# EAGLE design Calibration (EAGLE 9.2.2)
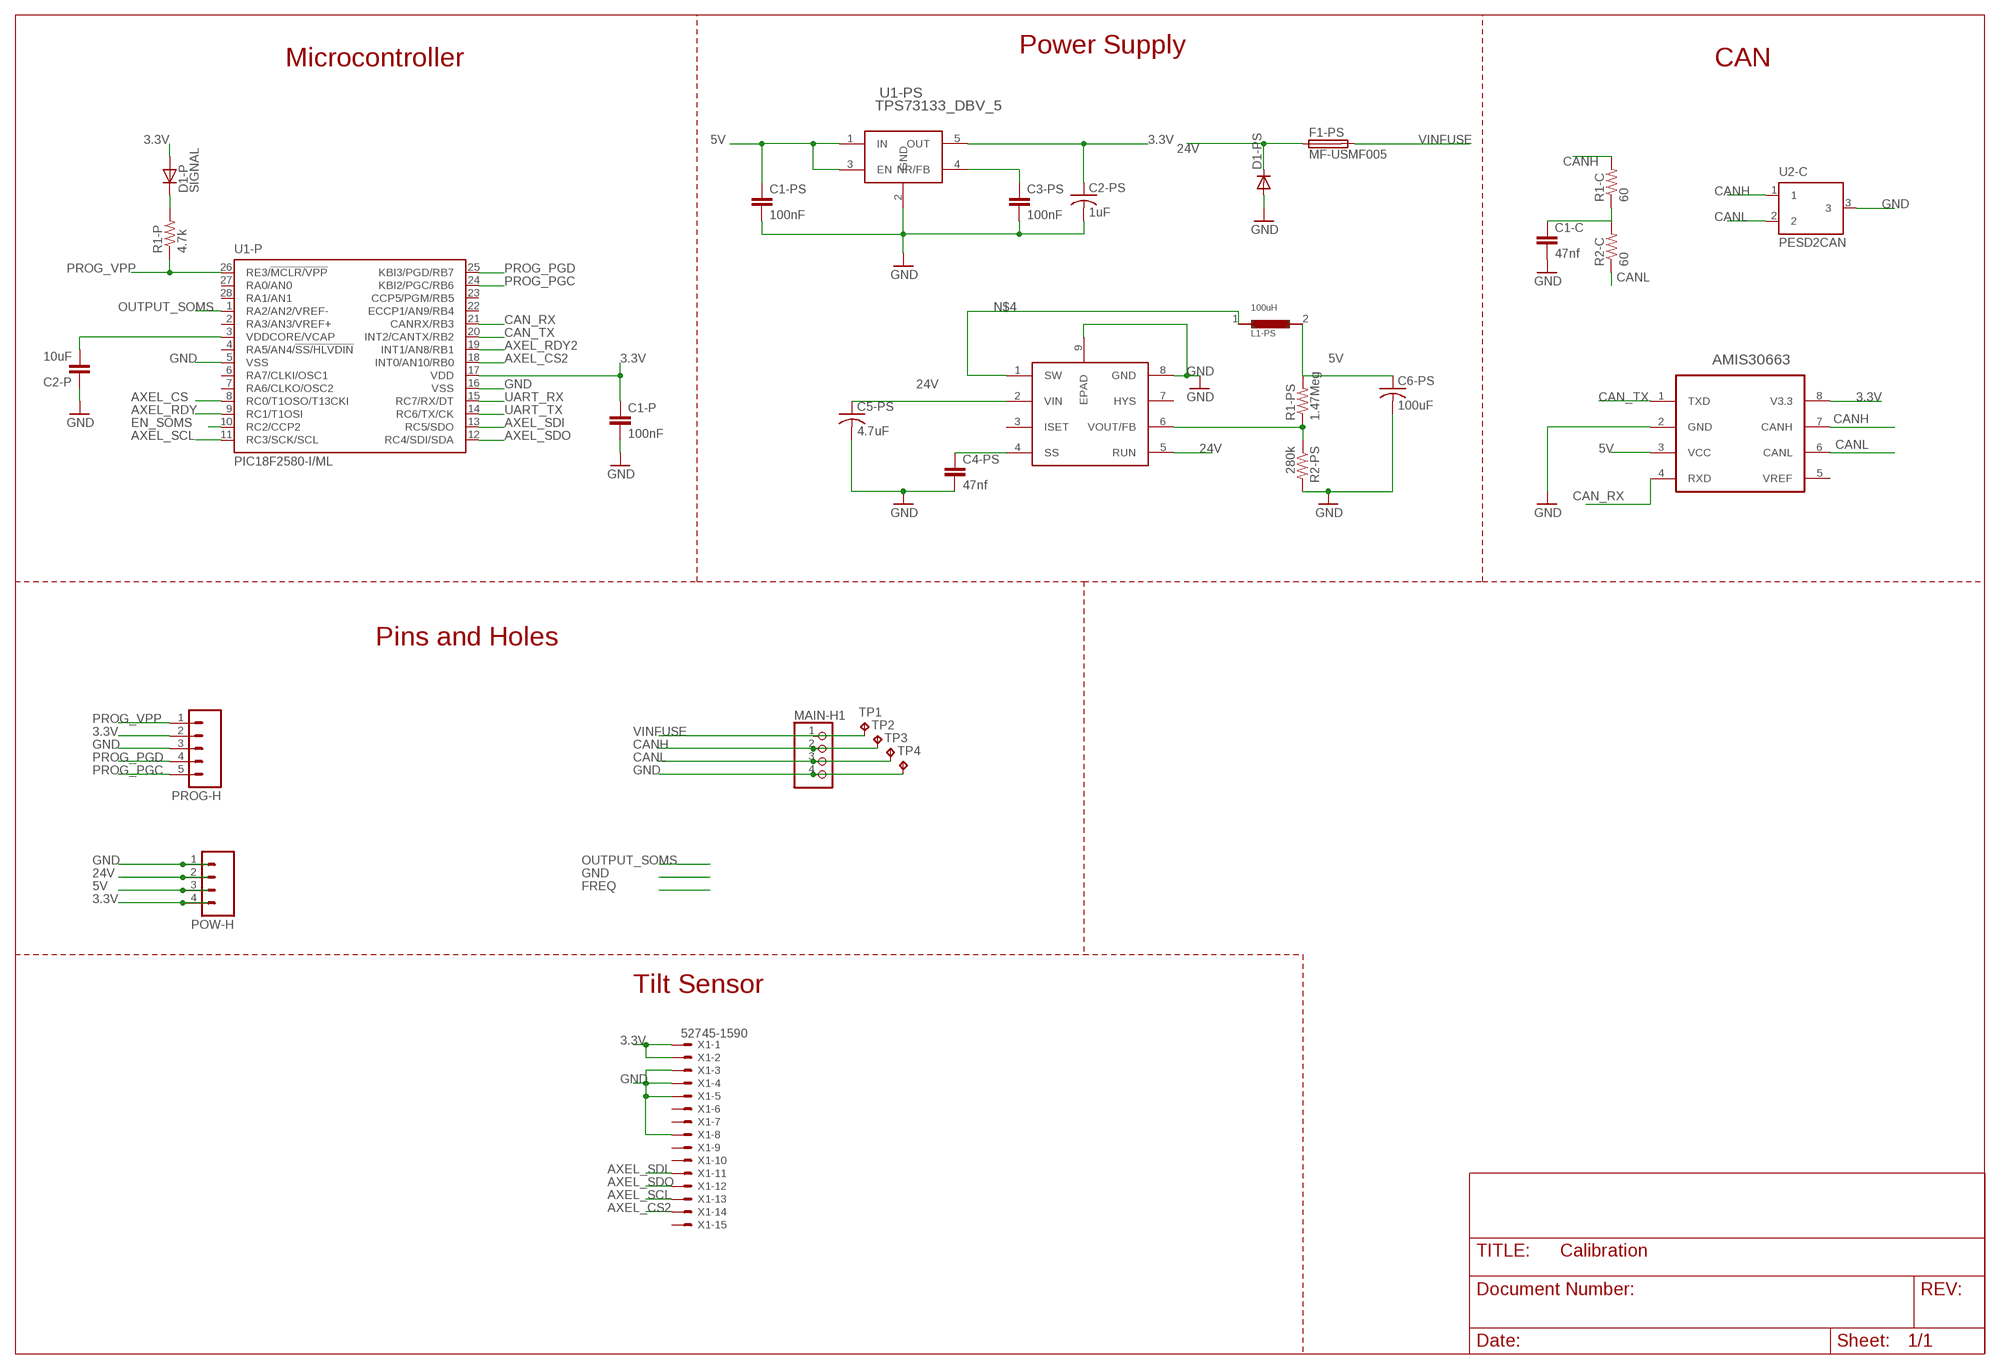
[diagram p0: schematic, sheet 1]

## Parts
C1-C  47nf  C-EUC0805  [C0805]
C1-P  100nF  C-EUC0603  [C0603]
C1-PS  100nF  C-EUC0603  [C0603]
C2-P  10uF  C-EUC0603  [C0603]
C2-PS  1uF  C-USC0402  [C0402]
C3-PS  100nF  C-EUC0603  [C0603]
C4-PS  47nf  C-EUC0805  [C0805]
C5-PS  4.7uF  C-USC1206K  [C1206K]
C6-PS  100uF  C-USC1210K  [C1210K]
D1-P  SIGNAL  DIODE0603  [DIODE-0603]
D1-PS  DIODE-DO-214AC  [DO-214AC]
F1-PS  MF-USMF005  MF-USMF075  [1210]
L1-PS  100uH  LQH32PN101MN0L  [1210]
MAIN-H1  PINHD-1X04_2.54  [1X04]
POW-H  M041X04_NO_SILK  [1X04_NO_SILK]
PROG-H  M05PTH  [1X05]
R1-C  60  R-US_R0805  [R0805]
R1-P  4.7k  R-US_R0603  [R0603]
R1-PS  1.47Meg  R-US_R0805  [R0805]
R2-C  60  R-US_R0805  [R0805]
R2-PS  280k  R-US_R0805  [R0805]
TP1  TPTP10SQ  [TP10SQ]
TP2  TPTP10SQ  [TP10SQ]
TP3  TPTP10SQ  [TP10SQ]
TP4  TPTP10SQ  [TP10SQ]
U1-P  PIC18F2580-I/ML  [QFN28-ML_6X6MM]
U1-PS  TPS73133_DBV_5  [DBV5]
U2  AMIS30663CAN  [SOIC8]
U2-C  PESD2CAN  [SOT23]
U2-PS  LTC3631-5  LTC3631  [MSOP8E]
X1  52745-1590  [52745-1590]

## Nets
3.3V: C1-P.1 C2-PS.1 D1-P.A POW-H.4 PROG-H.2 U1-P.17(VDD) U1-PS.5(OUT) U2.8(V3.3) X1.1 X1.2
5V: C1-PS.1 C6-PS.1 L1-PS.2 POW-H.3 R1-PS.2 U1-PS.1(IN) U1-PS.3(EN) U2.3(VCC)
24V: C5-PS.1 D1-PS.1(C) F1-PS.1 POW-H.2 U2-PS.2(VIN) U2-PS.5(RUN)
AXEL_CS: U1-P.8(RC0/T1OSO/T13CKI)
AXEL_CS2: U1-P.18(INT0/AN10/RB0) X1.14
AXEL_RDY: U1-P.9(RC1/T1OSI)
AXEL_RDY2: U1-P.19(INT1/AN8/RB1)
AXEL_SCL: U1-P.11(RC3/SCK/SCL) X1.13
AXEL_SDI: U1-P.13(RC5/SDO) X1.11
AXEL_SDO: U1-P.12(RC4/SDI/SDA) X1.12
CAN_RX: U1-P.21(CANRX/RB3) U2.4(RXD)
CAN_TX: U1-P.20(INT2/CANTX/RB2) U2.1(TXD)
CANH: MAIN-H1.2 R1-C.2 TP2.TP U2-C.1 U2.7(CANH)
CANL: MAIN-H1.3 R2-C.1 TP3.TP U2-C.2 U2.6(CANL)
EN_SOMS: U1-P.10(RC2/CCP2)
GND: C1-C.2 C1-P.2 C1-PS.2 C2-P.1 C2-PS.2 C3-PS.2 C4-PS.2 C5-PS.2 C6-PS.2 D1-PS.2(A) MAIN-H1.4 POW-H.1 PROG-H.3 R2-PS.2 TP4.TP U1-P.5(VSS) U1-P.16(VSS) U1-PS.2(GND) U2-C.3 U2-PS.8(GND) U2-PS.9(EPAD) U2.2(GND) X1.3 X1.4 X1.5 X1.8
N$3: C1-C.1 R1-C.1 R2-C.2
N$4: L1-PS.1 U2-PS.1(SW)
N$5: C3-PS.1 U1-PS.4(NR/FB)
N$6: R1-PS.1 R2-PS.1 U2-PS.6(VOUT/FB)
N$7: D1-P.C R1-P.2
N$8: C4-PS.1 U2-PS.4(SS)
N$19: C2-P.2 U1-P.3(VDDCORE/VCAP)
OUTPUT_SOMS: U1-P.1(RA2/AN2/VREF-)
PROG_PGC: PROG-H.5 U1-P.24(KBI2/PGC/RB6)
PROG_PGD: PROG-H.4 U1-P.25(KBI3/PGD/RB7)
PROG_VPP: PROG-H.1 R1-P.1 U1-P.26(RE3/!MCLR/VPP)
UART_RX: U1-P.15(RC7/RX/DT)
UART_TX: U1-P.14(RC6/TX/CK)
VINFUSE: F1-PS.2 MAIN-H1.1 TP1.TP
Unconnected: U1-P.2(RA3/AN3/VREF+) U1-P.4(RA5/AN4/!SS/HLVDIN) U1-P.6(RA7/CLKI/OSC1) U1-P.7(RA6/CLKO/OSC2) U1-P.22(ECCP1/AN9/RB4) U1-P.23(CCP5/PGM/RB5) U1-P.27(RA0/AN0) U1-P.28(RA1/AN1) U2-PS.3(ISET) U2-PS.7(HYS) U2.5(VREF) X1.6 X1.7 X1.9 X1.10 X1.15

## Notes on the sheet
- Power Supply
- Microcontroller | CAN
- Pins and Holes
- Tilt Sensor

## Library data of the parts
C1-C C1-PS C2-P C3-PS C4-PS = rcl:C-EU: CAPACITOR, European symbol
C1-P = resistor:C-EU: CAPACITOR, European symbol
C2-PS C5-PS C6-PS = rcl:C-US: CAPACITOR, American symbol
D1-P = signal_diode:DIODE: Signal diode
D1-PS = dp_devices:DIODE: Various Diode Packages
F1-PS = DRMScustomlib:MF-USMF075
L1-PS = 1210_inductor:LQH32PN101MN0L
MAIN-H1 = pinhead-2:PINHD-1X04: PIN HEADER
POW-H = SparkFun-Connectors:M04: Header 4 Standard 4-pin 0.1" header. Use with straight break away headers (SKU : PRT-00116), right angle break away headers (PRT-00553), swiss pins (PRT-00743), machine pins (PRT-00117), and female headers (PRT-00115). Molex polarized connector foot print use with SKU : PRT-08231 with associated crimp pins and housings. 1MM SMD Version SKU: PRT-10208
PROG-H = SparkFun-Connectors:M05: Header 5 Standard 5-pin 0.1" header. Use with straight break away headers (SKU : PRT-00116), right angle break away headers (PRT-00553), swiss pins (PRT-00743), machine pins (PRT-00117), and female headers (PRT-00115). Molex polarized connector foot print use with SKU : PRT-08230 with associated crimp pins and housings.
R1-C R1-PS R2-C R2-PS = rcl:R-US_: RESISTOR, American symbol
R1-P = resistor:R-US_: RESISTOR, American symbol
TP1-TP4 = testpad:TP: Test pad
U1-P = PIC18f25k80:PIC18F2*80: 28-Pin Enhanced Flash Microcontrollers with ECAN(TM) Technology 10-Bit A/D and nanoWatt Technology Source: http://www.microchip.com .. 39637a.pdf; MF: MICROCHIP; MPN: PIC18F2580-I/ML; OC_FARNELL: 1556180; OC_NEWARK: 71J7242
U1-PS = DRMScustomlib:TPS73133_DBV_5; DATASHEETURL: http://www.ti.com/lit/gpn/TPS73133; DESCRIPTION: Single Output LDO, 150mA, Fixed(3.3V), Cap free, Low Noise, Fast Transient Response; FAMILY_NAME: SINGLE CHANNEL LDO; GENERIC_PART_NUMBER: TPS73133; INDUSTRY_STD_PKG_TYPE: SOT-23; MANUFACTURER: Texas Instruments; MANUFACTURER_PART_NUMBER: tps73133_dbv_5; PACKAGE_DESIGNATOR: DBV; PIN_COUNT: 5; VENDOR: Texas Instruments
U2 = khr_lib4:AMIS30663CAN: https://www.onsemi.com/pub/Collateral/AMIS-30663-D.PDF; MPN: AMIS30663; OC_FARNELL: -; OC_NEWARK: 75C7726; PACKAGE: SOIC-8; SUPPLIER: On Semiconductor
U2-C = PESD2CAN:PESD2CAN
U2-PS = DRMScustomlib:LTC3631
X1 = con-molex:52745-1590: FFC/FPC-to-Board 0.50mm (.020") SMT Top Contact Right Angle, ZIF, Style Receptacle 52745 / 52435 Source: http://www.molex.com/product/ffc/52745.html; MF: MOLEX; MPN: 52745-1590; OC_FARNELL: unknown; OC_NEWARK: 92M6390

## Board
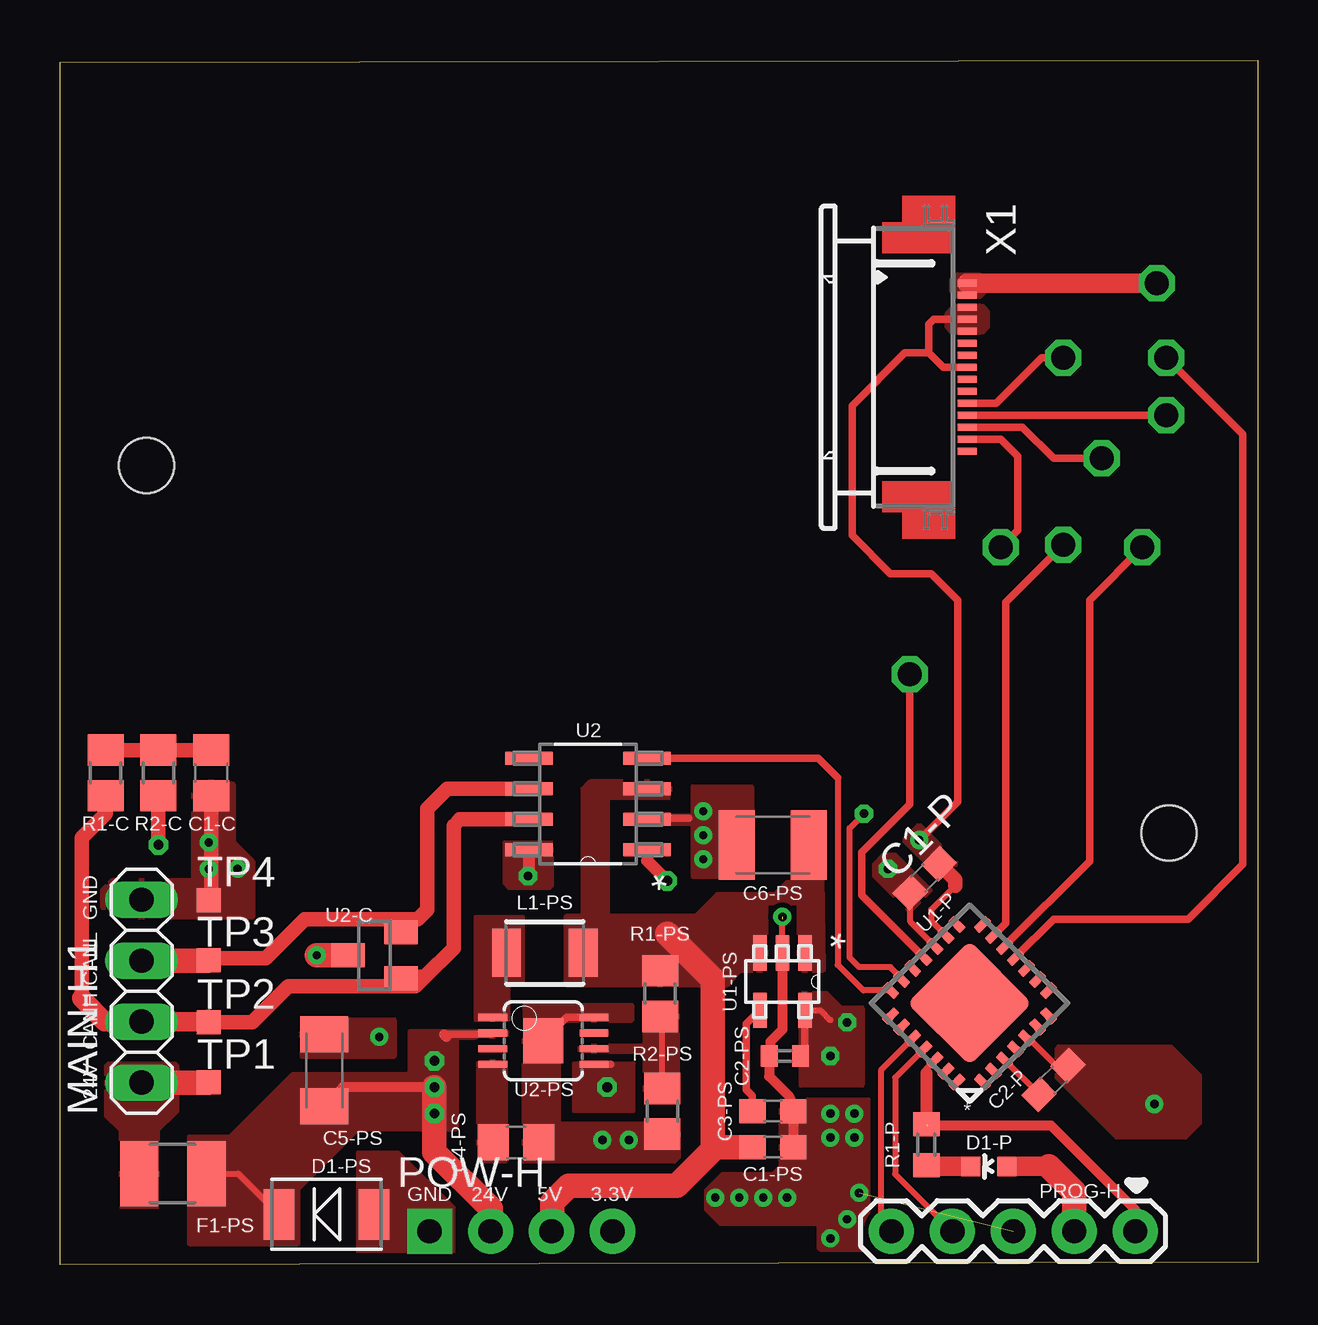
[diagram p1: board, top side]
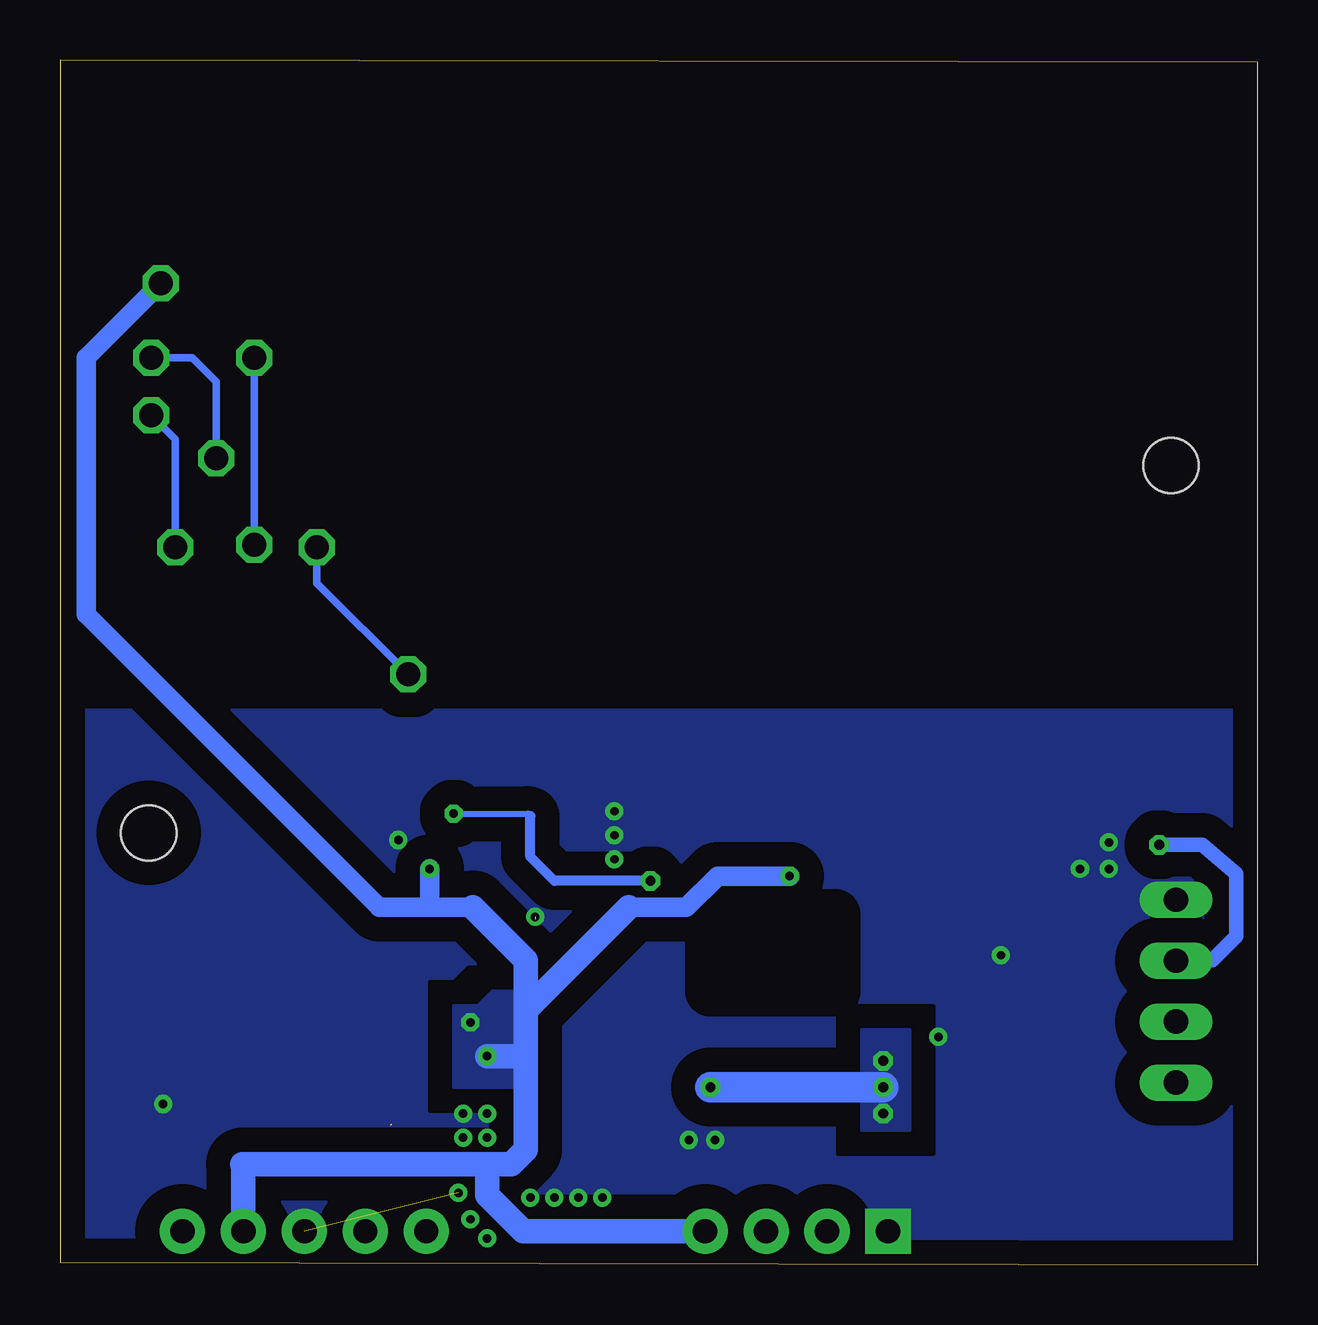
[diagram p2: board, bottom side, seen from below]

Size 49.9 x 50.2 mm. Coordinates in mm from the lower left corner, seen from the top.
Outline: 49.9,50.2 49.9,0.1 0,0 0,50.1 49.9,50.2
Copper layers (1*16): Top 0.035mm / dielectric 0.5mm / Route 0.035mm
Design rules "default *": minimum track width 6mil, minimum drill 6mil, track to track 8mil, track to pad 8mil, pad to pad 8mil, via to via 8mil, smd to smd 0mil, copper to edge 18mil, drill to drill 8mil, minimum pad ring 10mil, minimum via ring 8mil, stop-mask expansion 4mil, vias tented up to drill 0mil, thermal gap 0mil
Holes 2.3 mm at 3.6,33.3 46.2,18
bRestrict: area 17.6,11.4 to 22.8,14.6

### Footprints (pad centres in the part's own frame; a part is rotated, then mirrored left to right if it is on the bottom)
C0805 = smd 1.3 x 1.5: 1 -0.95,0; 2 0.95,0
C0603 = smd 1.1 x 1: 1 -0.85,0; 2 0.85,0
C0402 = smd 0.7 x 0.9: 1 -0.65,0; 2 0.65,0
C1206K = smd 1.5 x 2: 1 -1.5,0; 2 1.5,0
C1210K = smd 1.5 x 2.9: 1 -1.5,0; 2 1.5,0
DIODE-0603 = smd 0.8 x 0.8: A 0,-0.75; C 0,0.75
DO-214AC = smd 1.27 x 2.1: 1 -1.98,0; 2 1.98,0
1210 = smd 1.6 x 2.7: 1 -1.4,0; 2 1.4,0
1210' = smd 1.2 x 2: 1 -1.6,0; 2 1.6,0
1X04 = drill 1.016 long: 1 -3.81,0; 2 -1.27,0; 3 1.27,0; 4 3.81,0
1X04_NO_SILK = drill 1.016 pad 1.88 square: 1 0,0 | drill 1.016 pad 1.88: 2 2.54,0; 3 5.08,0; 4 7.62,0
1X05 = drill 1.016 pad 1.88: 1 0,0; 2 2.54,0; 3 5.08,0; 4 7.62,0; 5 10.16,0
R0805 = smd 1.3 x 1.5: 1 -0.95,0; 2 0.95,0
R0603 = smd 1 x 1.1: 1 -0.85,0; 2 0.85,0
TP10SQ = smd 1 x 1: TP 0,0
QFN28-ML_6X6MM = smd 0.7 x 0.35: 1 -2.7,1.95; 2 -2.7,1.3; 3 -2.7,0.65; 4 -2.7,0; 5 -2.7,-0.65; 6 -2.7,-1.3; 7 -2.7,-1.95; 15 2.7,-1.95; 16 2.7,-1.3; 17 2.7,-0.65; 18 2.7,0; 19 2.7,0.65; 20 2.7,1.3; 21 2.7,1.95 | smd 0.35 x 0.7: 8 -1.95,-2.7; 9 -1.3,-2.7; 10 -0.65,-2.7; 11 0,-2.7; 12 0.65,-2.7; 13 1.3,-2.7; 14 1.95,-2.7; 22 1.95,2.7; 23 1.3,2.7; 24 0.65,2.7; 25 0,2.7; 26 -0.65,2.7; 27 -1.3,2.7; 28 -1.95,2.7 | smd 3.7 x 3.7: EXP 0,0
DBV5 = smd 1.473 x 0.559: 1 -1.194,0.94; 2 -1.194,0; 3 -1.194,-0.94; 4 1.194,-0.94; 5 1.194,0.94
SOIC8 = smd 1.981 x 0.559: 1 -0.464,4.405; 2 -0.464,3.135; 3 -0.464,1.865; 4 -0.464,0.595; 5 4.464,0.595; 6 4.464,1.865; 7 4.464,3.135; 8 4.464,4.405
SOT23 = smd 1 x 1.4: 1 -0.95,-1.1; 2 0.95,-1.1; 3 0,1.1
MSOP8E = smd 0.3 x 1.2: 1 0.294,0.427; 2 0.944,0.427; 3 1.594,0.427; 4 2.244,0.427; 5 2.244,4.652; 6 1.594,4.652; 7 0.944,4.652; 8 0.294,4.652 | smd 1.88 x 1.676: 9 1.27,2.54
52745-1590 = smd 0.3 x 0.8: 1 -3.5,2.5; 2 -3,2.5; 3 -2.5,2.5; 4 -2,2.5; 5 -1.5,2.5; 6 -1,2.5; 7 -0.5,2.5; 8 0,2.5; 9 0.5,2.5; 10 1,2.5; 11 1.5,2.5; 12 2,2.5; 13 2.5,2.5; 14 3,2.5; 15 3.5,2.5

### Placement (x,y rotation side)
C1-C  6.3,20.5 270 top
C1-P  36.03,16.11 45 top
C1-PS  29.7,4.9 0 top
C2-P  41.4,7.7 225 top
C2-PS  30.2,8.7 180 top
C3-PS  29.7,6.4 0 top
C4-PS  19,5.1 0 top
C5-PS  11,8.1 90 top
C6-PS  29.7,17.5 180 top
D1-P  38.7,4.1 90 top
D1-PS  11.1,2.1 0 top
F1-PS  4.7,3.8 180 top
L1-PS  100uH  [1210']  20.2,13 0 top
MAIN-H1  3.4,11.4 90 top
POW-H  15.4,1.4 0 top
PROG-H  44.8,1.4 180 top
R1-C  1.9,20.5 270 top
R1-P  36.1,5 270 top
R1-PS  25,11.3 90 top
R2-C  4.1,20.5 90 top
R2-PS  25.1,6.4 270 top
TP1  6.2,7.6 0 top
TP2  6.2,10.1 0 top
TP3  6.2,12.7 0 top
TP4  6.2,15.2 0 top
U1-P  37.9,10.9 135 top
U1-PS  30.1,11.8 270 top
U2  24,21.7 180 top
U2-C  13.1,12.9 90 top
U2-PS  17.6,10.6 270 top
X1  35.3,37.4 270 top

### Tracks (layer width: path | path; a pad name or v marks a point on that pad's centre or on a via)
3.3V  (via drill 0.35, 1)
  Top 0.254: U1-PS.5 31.69,10.61 32.1,10.2 | U1-P.17 35.43,14.29 C1-P.1
  Top 0.305: U1-PS.5 31.04,8.89 C2-PS.1
  Top 0.508: U2.8 19.54,16.24 v19.5,16.2
  Top 0.813: D1-P.A 41.2,4.1 | v45.7,40.9 X1.1
  Top 1.016: PROG-H.2 42.26,3.04 41.2,4.1
  Route 0.813: 34.5,14.9 32.7,14.9 | 26.2,14.9 23.8,14.9 22.5,16.2 v19.5,16.2 | v34.5,16.5 34.5,14.9 | v45.7,40.9 48.8,37.8 48.8,27.1 36.6,14.9 34.5,14.9
  Route 1.016: POW-H.4 30.6,1.4 32.1,2.9 32.1,4.2 | PROG-H.2 42.26,4.16 42.3,4.2 32.1,4.2 | 30.5,8.7 30.5,4.8 31.1,4.2 32.1,4.2 | 30.5,8.7 30.5,10.6 | 30.5,10.6 26.2,14.9 | 32.7,14.9 30.5,12.7 30.5,10.6 | v32.1,8.7 30.5,8.7
  other vias: 32.8,10.1
  pour Top: 30.9,11.3 31.9,11.3 32.5,10.7 33.4,10.7 33.4,7.5 30.9,7.5
  pour Top: 35.4,14.7 33.9,16.2 33.9,16.7 34.3,17.1 34.8,17.1 36.3,15.6
  pour Top: 18.5,17.6 18.5,15.9 18.7,15.7 20.4,15.7 20.5,15.8 20.5,17.6
  pour Route: 31.3,11.4 31.9,11.4 32.5,10.8 33.5,10.8 33.5,7.4 30.9,7.4 30.9,11.4
  pour Top: 38.2,41.2 37.4,41.2 37.2,41 37.2,40.9 37.2,40.6 37.3,40.5 37.4,40.4 38.2,40.4 38.3,40.4 38.5,40.6 38.5,41 38.3,41.2
5V
  Top 1.016: 25.3,13.8 27.2,11.9 27.2,4.9 | 27.2,4.9 27.2,4.8 25.7,3.3 21.2,3.3 20.5,2.6 20.5,1.42 POW-H.3 | C1-PS.1 27.2,4.9
  pour Top: 21.1,14.5 21.1,11.7 27.8,11.7 28.3,12.3 29.4,12.3 29.4,15.1 30.8,15.1 30.8,12.3 31.8,12.3 31.7,18.8 30.6,18.8 30.6,16.2 29.8,15.4 27.4,15.4 26.5,14.5 22.8,14.5 22.8,19.5 25.4,19.5 25.4,20.1 22.1,20.1 21.8,19.8 21.8,14.5
24V  (via drill 0.4)
  Top 0.254: F1-PS.1 7.42,3.8 D1-PS.1
  Top 0.305: 16,9.6 17.97,9.6 U2-PS.2 | U2-PS.5 22.94,8.36
  Top 0.406: 16.1,9.5 16,9.6 | v15.6,7.4 11.8,7.4 C5-PS.1
  Top 1.016: POW-H.2 17.94,2.36 15.6,4.7 v15.6,7.4
  Route 1.27: v15.6,7.4 v22.8,7.4
  other vias: 15.6,6.3 15.6,8.5
  pour Top (isolate 0.254): 5.4,5.3 5.4,0.9 9.9,0.9 9.9,3.2 12.4,5.7 16.5,5.7 16.5,9.5 18.6,9.5 18.6,9.7 14.6,9.7 14.6,7.9 9.7,7.9 7.1,5.3
  pour Top: 21.4,8.4 21.4,6.4 23.9,6.4 23.9,8.4
  pour Route: 16.5,5.6 16.5,9.8 14.5,9.8 14.5,5.6
AXEL_CS2  (via drill 1)
  Top 0.305: U1-P.18 33.4,15.4 33.4,17.2 35.4,19.2 v35.4,24.6 | v39.2,29.9 39.9,30.6 39.9,33.7 39.21,34.39 39.2,34.39 X1.14
  Route 0.305: v35.4,24.6 39.2,28.4 v39.2,29.9
AXEL_RDY
  Top 0.254: U1-P.9 40.79,11.89
AXEL_RDY2
  Top 0.254: U1-P.19 35.53,12.37
AXEL_SCL  (via drill 1)
  Top 0.305: U1-P.11 41.4,14.4 47,14.4 49.29,16.69 49.29,34.61 v46.1,37.8 | X1.13 40.1,34.9 41.4,33.6 v43.4,33.6
  Route 0.305: v46.1,37.8 44.4,37.8 43.4,36.8 v43.4,33.6
AXEL_SDI  (via drill 1)
  Top 0.305: X1.11 39,35.9 40.9,37.8 v41.8,37.8 | U1-P.13 39.4,14.24 39.4,27.6 v41.8,30
  Route 0.305: v41.8,30 v41.8,37.8
AXEL_SDO  (via drill 1)
  Top 0.254: U1-P.12 39.37,13.27
  Top 0.305: X1.12 v46.1,35.4 | v45.1,29.9 42.9,27.7 42.9,16.82 U1-P.12
  Route 0.305: v46.1,35.4 45.1,34.4 v45.1,29.9
CAN_RX
  Top 0.254: U1-P.21 33.47,11.43 32.4,12.5 32.4,20.3
  Top 0.305: U2.4 31.59,21.11 32.4,20.3
  Top 0.508: U2.4 24.8,21.11
CAN_TX  (via drill 0.35, 0.4)
  Top 0.254: U1-P.20 35.07,11.93 34.6,12.4 33.3,12.4 32.9,12.8 32.9,18.2 v33.5,18.8
  Top 0.508: U2.1 24.46,16.84 v25.3,16
  Route 0.254: v33.5,18.8 30.4,18.8 30.3,18.7
  Route 0.406: v25.3,16 29.3,16 30.3,17 30.3,18.7
CANH
  Top 0.61: R1-C.2 1.9,18.8 0.9,17.8 0.9,11.1 | U2.7 16.66,18.57 16.4,18.3 16.4,13.2 15.2,12 | 15.2,12 14.25,12 U2-C.1 | TP2.TP 8,10.1 9.5,11.6 14.8,11.6 15.2,12
  Top 0.813: 0.9,11.1 1.87,10.13 MAIN-H1.2 6.17,10.13
  Top 1.016: 6.17,10.13 TP2.TP
CANL  (via drill 0.4)
  Top 0.61: R2-C.1 v4.1,17.5 | TP3.TP 6.27,12.77 8.57,12.77 10.2,14.4 14.5,14.4 | 14.5,14.4 14.9,14.4 15.3,14.8 15.3,19 16.14,19.84 U2.6 | U2-C.2 14.2,14.1 14.5,14.4
  Top 1.016: MAIN-H1.3 6.17,12.67 TP3.TP
  Route 0.61: v4.1,17.5 2.3,17.5 0.9,16.3 0.9,13.7 1.9,12.7 3.37,12.7 MAIN-H1.3
GND  (via drill 0.35)  (2 unrouted)
  Top 0.254: U1-P.5 40.35,9.45 41.4,8.4 41.9,8.4 C2-P.1 | U1-P.16 36.3,14.34 36.3,14.8 37.3,15.8 | U1-PS.2 30.1,14.4
  Top 0.305: U2-PS.8 21.12,10.31 U2-PS.9 | 26.2,18.6 24.5,18.6 U2.2 | X1.8 36.8,37.4 36.2,38 | 36.2,38 36.2,39.2 36.4,39.4 37,39.4 | v35.8,17.7 37.4,19.3 37.4,27.7 36.3,28.8 34.6,28.8 33,30.4 33,35.8 35.2,38 36.2,38
  Top 0.406: U1-PS.2 30.1,9.8 29.6,9.3 29.6,8.75 C2-PS.2 29.55,7.85 30.4,7 30.4,6.35 C3-PS.2 C1-PS.2
  Top 0.61: C1-C.2 6.3,15.71 | C1-P.2 37.3,16.04 37.3,15.8
  Top 1.016: U2-C.3 v10.7,12.9
  other vias: 13.3,9.5 7.4,16.5 6.2,16.5 26.8,18.9 26.8,17.9 30.1,14.5 23.7,5.2 22.6,5.2 45.6,6.7 32.1,6.3 33.1,6.3 33.1,5.3 32.1,5.3 26.8,16.9 30.3,2.8 29.3,2.8 28.3,2.8 27.3,2.8 32.1,1.1 33.3,3 6.2,17.6 32.8,1.9
  pour Top (isolate 0.254): 1.8,14.9 1.8,15.6 2.2,16 5.6,16 5.6,20 5.7,20.1 7.1,20.1 7.2,20 7.2,17.6 8,16.8 8,14.5 2.2,14.5
  pour Top (isolate 0.254): 37.3,16.7 37.3,16.8 35.8,18.3 35.2,17.7 36.7,16.2 36.8,16.2
  pour Top (isolate 0.254): 10.1,10.2 13.9,10.2 13.9,8.7 10.1,8.7
  pour Top (isolate 0.254): 12.4,4.7 12.4,0.3 16.3,0.3 16.4,0.4 16.4,2.4 14.1,4.7
  pour Top: 19.3,10.1 19.3,4.3 25.8,4.3 25.8,5.9 20.8,5.9 20.8,10.1
  pour Top: 19.4,8.4 19.4,10.8 23.8,10.8 23.8,10.2 20.8,10.2 20.8,8.4
  pour Top: 26.4,19.9 28.8,19.9 28.8,16.2 26.4,16.2 26.4,18.4 23.6,18.4 23.6,18.7 26.4,18.7
  pour Top: 30,6.9 30,4.1 29.7,3.8 27.6,3.8 26.9,3.1 26.9,2.3 27.5,1.7 31.6,1.7 31.6,0.7 31.8,0.5 33.4,0.5 33.4,1.6 33.7,2.2 33.7,6.9
  pour Route (isolate 1.016, rank 6): -0.1,23.1 49.7,23.1 49.7,0 -0.1,0
  pour Top: 37.4,39.9 38.4,39.9 38.5,39.8 38.6,39.7 38.6,39.1 38.4,38.9 37.2,38.9 37.1,39 37,39.1 37,39.6 37.3,39.9
  pour Top: 41.5,7.8 44,5.3 45.3,5.3 46.9,5.3 47.4,5.8 47.5,5.9 47.5,7.9 46.3,9.1 41.6,9.1 41.5,9
N$3
  Top 0.61: R1-C.1 R2-C.2 C1-C.1
N$4
  pour Top (isolate 0.254): 18.7,10.2 17.3,10.2 17.3,14.5 19.3,14.5 19.3,11.7 18.7,11.7
N$5
  Top 0.305: C3-PS.1 28.85,7.05 28.6,7.3 28.6,10.05 U1-PS.4
N$6
  Top 0.254: R2-PS.1 25.1,10.25 R1-PS.1
  pour Top: 24.4,6.8 24.4,10.9 25.7,10.9 25.7,6.8
  pour Top: 21.7,9.1 24.5,9.1 24.5,8.9 21.7,8.9
N$7
  Top 0.254: 37.9,4.15 D1-P.C
  Top 0.813: R1-P.2 36.15,4.1 D1-P.C
N$8
  pour Top: 17.4,8.5 18.6,8.5 18.6,4.3 17.4,4.3
N$19
  Top 0.254: U1-P.3 39.37,8.53 C2-P.2
PROG_PGC
  Top 0.254: U1-P.24 35.53,9.43 34.2,8.1 34.2,4.2 34.2,1.84 PROG-H.5
PROG_PGD
  Top 0.254: U1-P.25 34.8,7.8 34.8,3.78 PROG-H.4
PROG_VPP  (1 unrouted)
  Top 0.254: 36.43,8.53 U1-P.26 36.1,8.18 36.1,8 | R1-P.1 35.9,6.05
  Top 0.406: PROG-H.1 44.8,2.3 41.3,5.8 36.15,5.8
  Top 0.508: 36.1,8 R1-P.1
VINFUSE
  Top 1.016: MAIN-H1.1 TP1.TP
  pour Top: 2.5,2.4 4.1,2.4 4.1,5.6 4.8,6.3 4.9,6.4 4.9,8.3 4.8,8.4 2,8.4 1.9,8.3 1.9,6.2 2.5,5.6

### Text on the board
tNames: GND | CANL | CANH | 24V | * | GND | 24V | 5V | 3.3V